# Altium project DARKYDEN.PrjPcb (part 1 of 17)
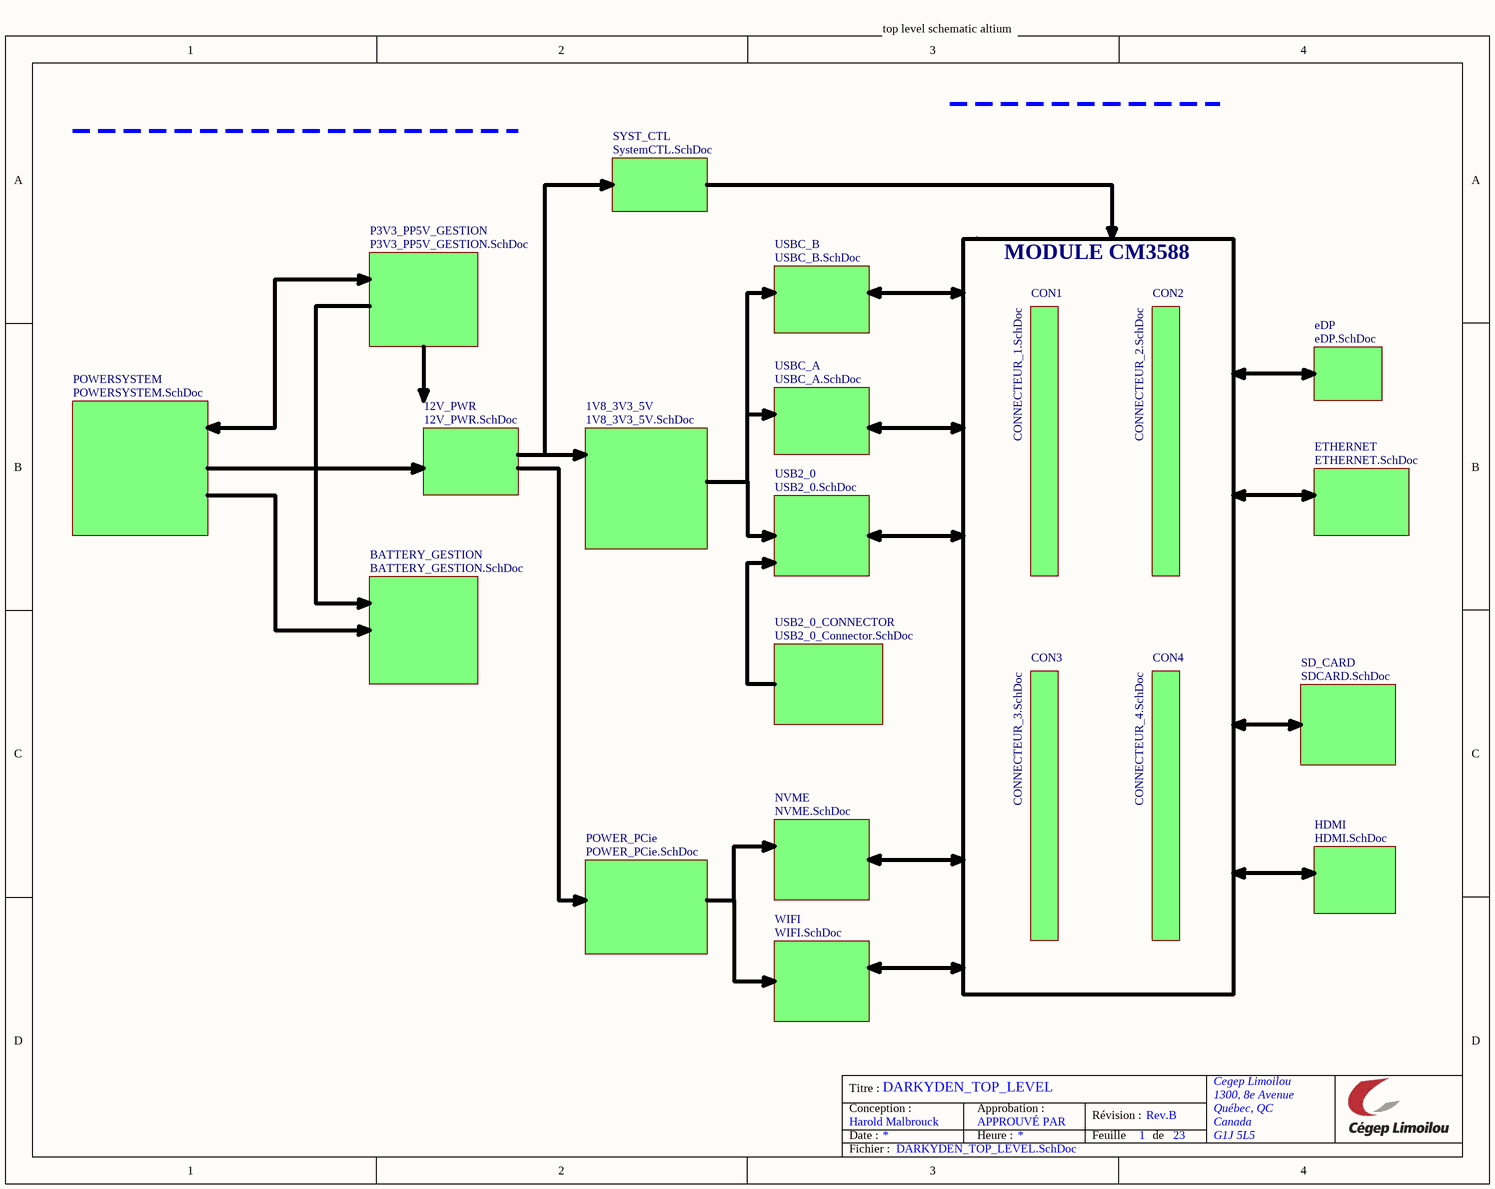
[diagram p0: DARKYDEN_TOP_LEVEL.SchDoc]
NomDeProjet: Mon Projet; Revision: Rev.C
17 sheets, 429 parts. Net scope: flat (ports and power ports of the same name join across sheets).
Board file: PCB1.PcbDoc
Sheets:
  DARKYDEN_TOP_LEVEL.SchDoc
    USBC_A = USBC_A.SchDoc
    USBC_B = USBC_B.SchDoc
    WIFI = WIFI.SchDoc
    NVME = NVME.SchDoc
    ETHERNET = ETHERNET.SchDoc
    HDMI = HDMI.SchDoc
    SD_CARD = SDCARD.SchDoc
    eDP = eDP.SchDoc
    USB2_0 = USB2_0.SchDoc
    SYST_CTL = SystemCTL.SchDoc
    POWERSYSTEM = POWERSYSTEM.SchDoc
    BATTERY_GESTION = BATTERY_GESTION.SchDoc
    12V_PWR = 12V_PWR.SchDoc
    P3V3_PP5V_GESTION = P3V3_PP5V_GESTION.SchDoc
    POWER_PCie = POWER_PCie.SchDoc
    CON3 = CONNECTEUR_3.SchDoc

## Sheet DARKYDEN_TOP_LEVEL.SchDoc: DARKYDEN_TOP_LEVEL
size Letter; ApprovedBy: APPROUVÉ PAR; Author: Harold Malbrouck; Organization: Cegep Limoilou; Address1: 1300, 8e Avenue; Address2: Québec, QC; Address3: Canada; Address4: G1J 5L5; Revision: Rev.B; SheetNumber: 1; SheetTotal: 23

### Sub-sheets
1V8_3V3_5V = 1V8_3V3_5V.SchDoc (file not in this document): no entries
12V_PWR = 12V_PWR.SchDoc: no entries
BATTERY_GESTION = BATTERY_GESTION.SchDoc: no entries
CON1 = CONNECTEUR_1.SchDoc (file not in this document): no entries
CON2 = CONNECTEUR_2.SchDoc (file not in this document): no entries
CON3 = CONNECTEUR_3.SchDoc: no entries
CON4 = CONNECTEUR_4.SchDoc (file not in this document): no entries
eDP = eDP.SchDoc: no entries
ETHERNET = ETHERNET.SchDoc: no entries
HDMI = HDMI.SchDoc: no entries
NVME = NVME.SchDoc: no entries
P3V3_PP5V_GESTION = P3V3_PP5V_GESTION.SchDoc: no entries
POWER_PCie = POWER_PCie.SchDoc: no entries
POWERSYSTEM = POWERSYSTEM.SchDoc: no entries
SD_CARD = SDCARD.SchDoc: no entries
SYST_CTL = SystemCTL.SchDoc: no entries
USB2_0 = USB2_0.SchDoc: no entries
USB2_0_CONNECTOR = USB2_0_Connector.SchDoc (file not in this document): no entries
USBC_A = USBC_A.SchDoc: no entries
USBC_B = USBC_B.SchDoc: no entries
WIFI = WIFI.SchDoc: no entries

### Notes on the sheet
- top level schematic altium
- MODULE CM3588
- Titre :
- Conception :
- Date :
- Approbation :
- Heure :
- Révision :
- Feuille
- de
- Fichier :